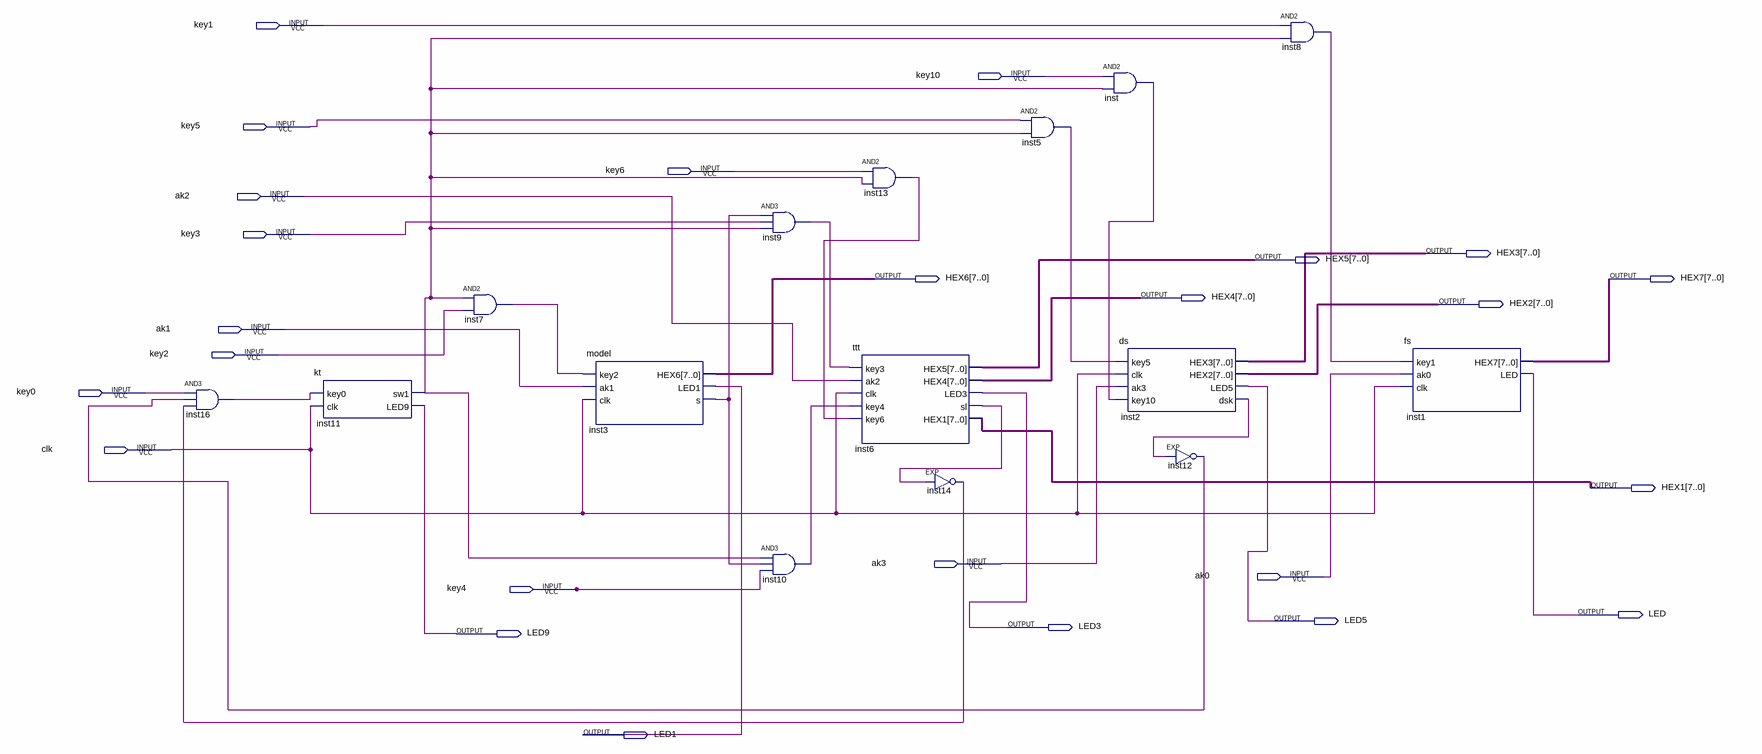
[diagram p0: schematic sheet]
// Quartus schematic total.bdf as structural Verilog: 15 symbols, 25 pins
module total (
  input  key1,
  input  key10,
  input  key5,
  input  key6,
  input  ak2,
  input  key3,
  input  ak1,
  input  key2,
  input  key0,
  input  clk,
  input  ak3,
  input  ak0,
  input  key4,
  output [7:0] HEX3,
  output [7:0] HEX5,
  output [7:0] HEX6,
  output [7:0] HEX7,
  output [7:0] HEX4,
  output [7:0] HEX2,
  output [7:0] HEX1,
  output LED,
  output LED5,
  output LED3,
  output LED9,
  output LED1
);

  wire inst2_dsk, inst3_s, inst5_out, inst6_sl, inst7_out, inst8_out, inst9_out, inst10_out, inst11_sw1,
       inst12_out, inst13_out, inst14_out, inst16_out, inst_out;

  and inst16 (inst16_out, key0, inst12_out, inst14_out);
  kt inst11 (.key0(inst16_out), .clk(clk), .sw1(inst11_sw1), .LED9(LED9));
  and inst7 (inst7_out, inst11_sw1, key2);
  model inst3 (.key2(inst7_out), .ak1(ak1), .clk(clk), .HEX6(HEX6), .LED1(LED1), .s(inst3_s));
  and inst9 (inst9_out, inst3_s, key3, inst11_sw1);
  and inst10 (inst10_out, inst11_sw1, inst3_s, key4);
  and inst13 (inst13_out, key6, inst11_sw1);
  ttt inst6 (
    .key3(inst9_out), .ak2(ak2), .clk(clk), .key4(inst10_out), .key6(inst13_out), .HEX5(HEX5), .HEX4(HEX4),
    .LED3(LED3), .sl(inst6_sl), .HEX1(HEX1));
  EXP inst14 (.IN(inst6_sl), .OUT(inst14_out));
  and inst5 (inst5_out, key5, inst11_sw1);
  and inst (inst_out, key10, inst11_sw1);
  ds inst2 (
    .key5(inst5_out), .clk(clk), .ak3(ak3), .key10(inst_out), .HEX3(HEX3), .HEX2(HEX2), .LED5(LED5),
    .dsk(inst2_dsk));
  EXP inst12 (.IN(inst2_dsk), .OUT(inst12_out));
  and inst8 (inst8_out, key1, inst11_sw1);
  fs inst1 (.key1(inst8_out), .ak0(ak0), .clk(clk), .HEX7(HEX7), .LED(LED));
endmodule
